# EAGLE design PS4 controller breakout (EAGLE 9.7.0)
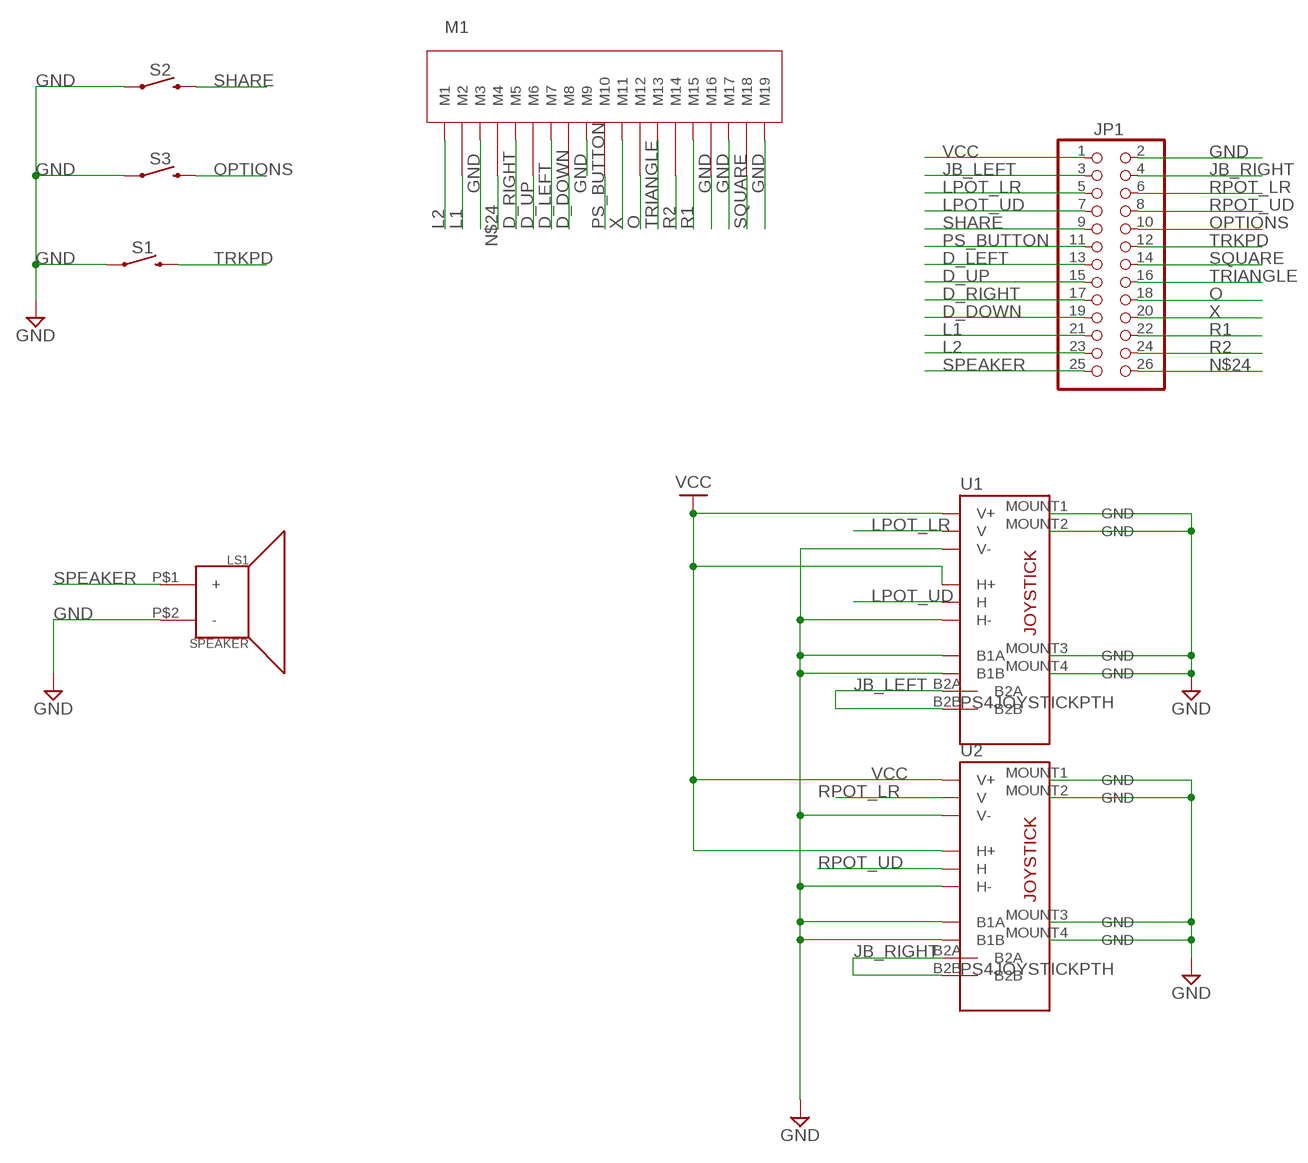
[diagram p0: schematic, sheet 1]

## Parts
JP1  PINHD-2X13  [2X13]
LS1  SPEAKER  [PS4_SPEAKER]
M1  PS4MEMBRANE  [PS4MEMBRANE]
S1  MOMENTARY-SWITCH-SPST-SMD-5.2MM  [TACTILE_SWITCH_SMD_6MM]
S2  MOMENTARY-SWITCH-SPST-SMD-4.5MM  [TACTILE_SWITCH_SMD_3.6MM]
S3  MOMENTARY-SWITCH-SPST-SMD-4.5MM  [TACTILE_SWITCH_SMD_3.6MM]
U1  PS4JOYSTICKPTH  [PS4JOYSTICK]
U2  PS4JOYSTICKPTH  [PS4JOYSTICK]

## Nets
D_DOWN: JP1.19 M1.8(M8)
D_LEFT: JP1.13 M1.7(M7)
D_RIGHT: JP1.17 M1.5(M5)
D_UP: JP1.15 M1.6(M6)
GND: JP1.2 LS1.P$2(-) M1.3(M3) M1.9(M9) M1.16(M16) M1.17(M17) M1.19(M19) S1.1 S2.2 S2.3 S3.2 S3.3 U1.B1A U1.B1B U1.H3(H-) U1.MOUNT1(GND) U1.MOUNT2(GND) U1.MOUNT3(GND) U1.MOUNT4(GND) U1.V3(V-) U2.B1A U2.B1B U2.H3(H-) U2.MOUNT1(GND) U2.MOUNT2(GND) U2.MOUNT3(GND) U2.MOUNT4(GND) U2.V3(V-)
JB_LEFT: JP1.3 U1.B2A U1.B2B
JB_RIGHT: JP1.4 U2.B2A U2.B2B
L1: JP1.21 M1.2(M2)
L2: JP1.23 M1.1(M1)
LPOT_LR: JP1.5 U1.V2(V)
LPOT_UD: JP1.7 U1.H2(H)
N$24: JP1.26 M1.4(M4)
O: JP1.18 M1.12(M12)
OPTIONS: JP1.10 S3.1 S3.4
PS_BUTTON: JP1.11 M1.10(M10)
R1: JP1.22 M1.15(M15)
R2: JP1.24 M1.14(M14)
RPOT_LR: JP1.6 U2.V2(V)
RPOT_UD: JP1.8 U2.H2(H)
SHARE: JP1.9 S2.1 S2.4
SPEAKER: JP1.25 LS1.P$1(+)
SQUARE: JP1.14 M1.18(M18)
TRIANGLE: JP1.16 M1.13(M13)
TRKPD: JP1.12 S1.3
VCC: JP1.1 U1.H1(H+) U1.V1(V+) U2.H1(H+) U2.V1(V+)
X: JP1.20 M1.11(M11)

## Library data of the parts
JP1 = pinhead:PINHD-2X13: PIN HEADER
LS1 = controller:SPEAKER: Speaker Generic 2-terminal loudspeakers SparkFun Products Speaker - PCB Mount <https://www.sparkfun.com/products/11089> (COM-11089)
M1 = controller:PS4MEMBRANE
S1 = controller:MOMENTARY-SWITCH-SPST: Momentary Switch (Pushbutton) - SPST Normally-open (NO) SPST momentary switches (buttons, pushbuttons). Variants PTH-12MM - 12mm square, through-hole Momentary Pushbutton Switch - 12mm Square <https://www.sparkfun.com/products/9190> (COM-09190) PTH-6.0MM, PTH-6.0MM-KIT - 6.0mm square, through-hole Mini Pushbutton Switch <https://www.sparkfun.com/products/97> (COM-00097) KIT package intended for soldering kit's - only one side of pads' copper is exposed. PTH-RIGHT-ANGLE-KIT - Right-angle, through-hole Right Angle Tactile Button <https://www.sparkfun.com/products/10791> - Used on SparkFun BigTime Watch Kit <https://www.sparkfun.com/products/11734> SMD-12MM - 12mm square, surface-mount Tactile Button - SMD (12mm) <https://www.sparkfun.com/products/12993> (COM-12993) Used on SparkFun PicoBoard <https://www.sparkfun.com/products/11888> SMD-4.5MM - 4.5mm Square Trackball Switch Used on SparkFun Blackberry Trackballer Breakout <https://www.sparkfun.com/products/13169> SMD-4.6MMX2.8MM - 4.60mm x 2.80mm, surface mount Used on SparkFun SAMD21 Mini Breakout <https://www.sparkfun.com/products/13664> SMD-5.2MM, SMD-5.2-REDUNDANT - 5.2mm square, surface-mount Mini Pushbutton Switch - SMD <https://www.sparkfun.com/products/8720> (COM-08720) Used on Arduino Pro Mini <https://www.sparkfun.com/products/11114> REDUNDANT package connects both switch circuits together SMD-6.0X3.5MM - 6.0 x 3.5mm, surface mount Momentary Reset Switch SMD <https://www.sparkfun.com/products/8229> (COM-08229) SMD-6.2MM-TALL - 6.2mm square, surface mount Tactile Button - SMD (6mm) <https://www.sparkfun.com/products/12992> Used on SparkFun Digital Sandbox <https://www.sparkfun.com/products/12651> SMD-RIGHT-ANGLE - Right-angle, surface mount Used on SparkFun Block for Intel® Edison - Arduino <https://www.sparkfun.com/products/13036>; PROD_ID: SWCH-08247; SF_SKU: COM-08720
S2 S3 = controller:MOMENTARY-SWITCH-SPST: Momentary Switch (Pushbutton) - SPST Normally-open (NO) SPST momentary switches (buttons, pushbuttons). Variants PTH-12MM - 12mm square, through-hole Momentary Pushbutton Switch - 12mm Square <https://www.sparkfun.com/products/9190> (COM-09190) PTH-6.0MM, PTH-6.0MM-KIT - 6.0mm square, through-hole Mini Pushbutton Switch <https://www.sparkfun.com/products/97> (COM-00097) KIT package intended for soldering kit's - only one side of pads' copper is exposed. PTH-RIGHT-ANGLE-KIT - Right-angle, through-hole Right Angle Tactile Button <https://www.sparkfun.com/products/10791> - Used on SparkFun BigTime Watch Kit <https://www.sparkfun.com/products/11734> SMD-12MM - 12mm square, surface-mount Tactile Button - SMD (12mm) <https://www.sparkfun.com/products/12993> (COM-12993) Used on SparkFun PicoBoard <https://www.sparkfun.com/products/11888> SMD-4.5MM - 4.5mm Square Trackball Switch Used on SparkFun Blackberry Trackballer Breakout <https://www.sparkfun.com/products/13169> SMD-4.6MMX2.8MM - 4.60mm x 2.80mm, surface mount Used on SparkFun SAMD21 Mini Breakout <https://www.sparkfun.com/products/13664> SMD-5.2MM, SMD-5.2-REDUNDANT - 5.2mm square, surface-mount Mini Pushbutton Switch - SMD <https://www.sparkfun.com/products/8720> (COM-08720) Used on Arduino Pro Mini <https://www.sparkfun.com/products/11114> REDUNDANT package connects both switch circuits together SMD-6.0X3.5MM - 6.0 x 3.5mm, surface mount Momentary Reset Switch SMD <https://www.sparkfun.com/products/8229> (COM-08229) SMD-6.2MM-TALL - 6.2mm square, surface mount Tactile Button - SMD (6mm) <https://www.sparkfun.com/products/12992> Used on SparkFun Digital Sandbox <https://www.sparkfun.com/products/12651> SMD-RIGHT-ANGLE - Right-angle, surface mount Used on SparkFun Block for Intel® Edison - Arduino <https://www.sparkfun.com/products/13036>; PROD_ID: SWCH-09213
U1 U2 = ps4joystick:PS4JOYSTICK: Thumb Joystick Joystick commonly found in PS2 controllers. Two pots and a select switch. Adapted from Sparkfun Library (but for more common 6mm switch sticks)

## Board
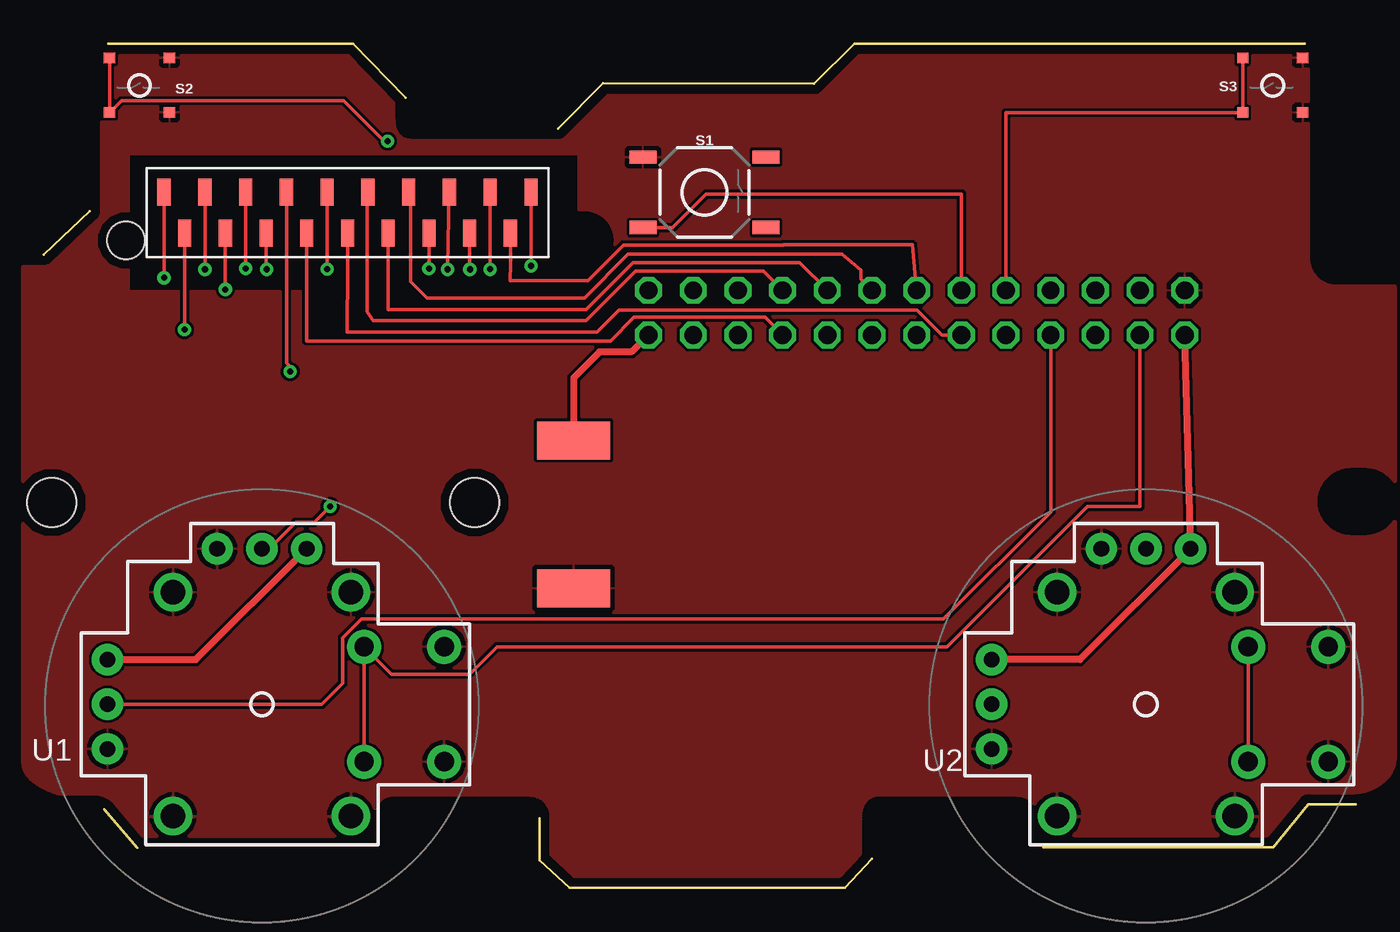
[diagram p1: board, top side]
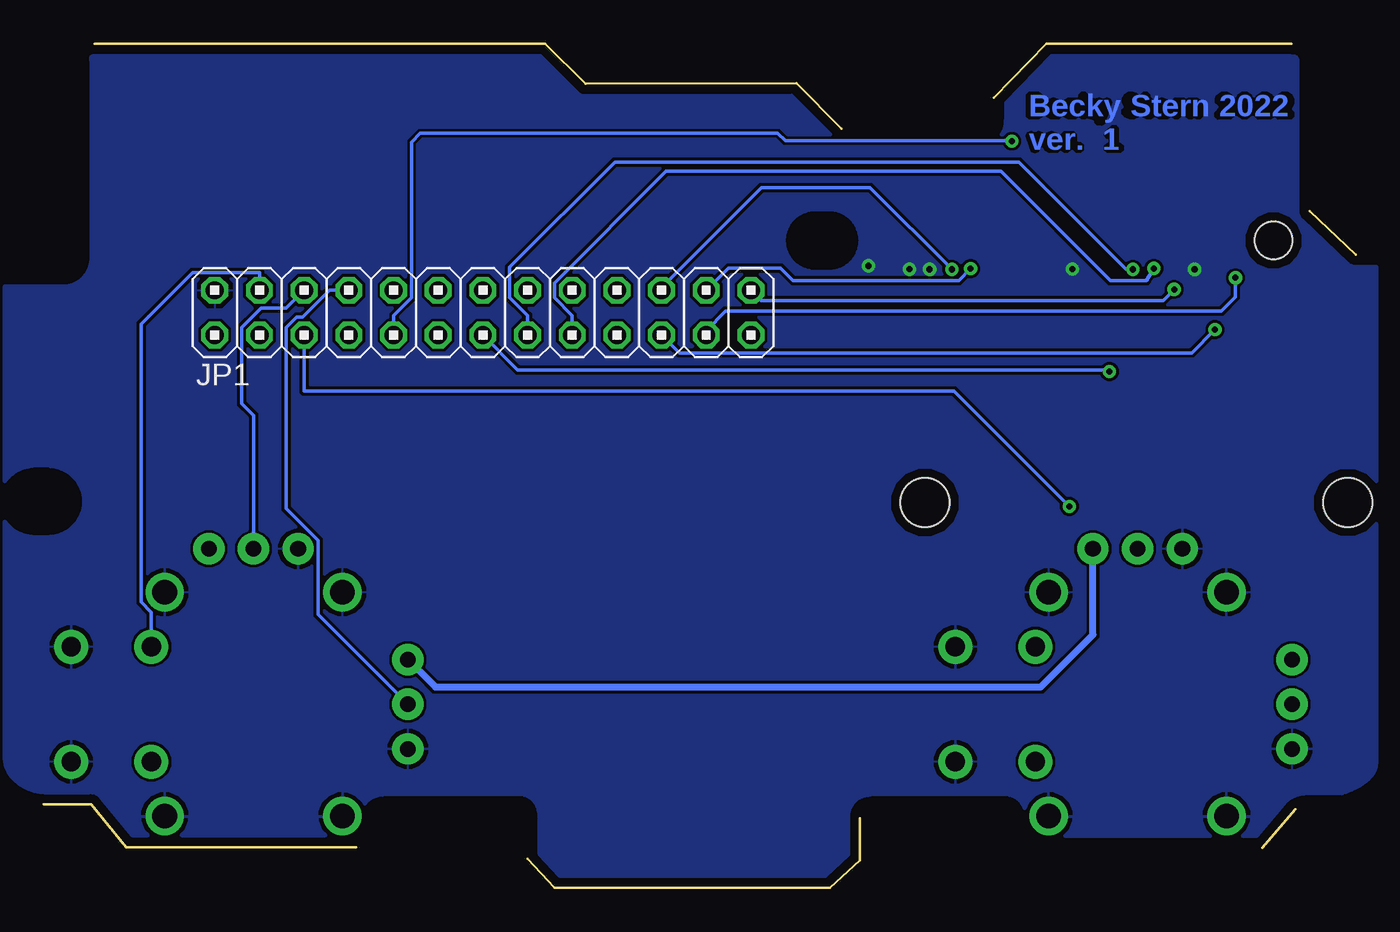
[diagram p2: board, bottom side, seen from below]

Size 74.56 x 47.99 mm. Coordinates in mm from the lower left corner, seen from the top.
Outline: 2.61,38.49 0,36.01
Outline: 3.43,4.48 5.29,2.27
Outline: 28.17,3.97 28.17,1.56 29.87,0 45.55,0 47.07,1.66
Outline: 56.83,2.31 69.88,2.31 71.88,4.75 74.56,4.75
Outline: 71.68,47.99 46.07,47.99 43.78,45.72 31.79,45.76 29.22,43.17
Outline: 20.56,44.93 17.57,47.99 3.66,47.99
Copper layers (1*16): Top / Bottom
Stack-up Default Layer Stack: Top User Defined 0.035mm / Dielectric-1 User Defined 1.5mm / Bottom User Defined 0.035mm
Design rules "default *": minimum track width 8mil, minimum drill 0.35mm, track to track 6mil, track to pad 6mil, pad to pad 6mil, via to via 6mil, smd to smd 6mil, copper to edge 20mil, drill to drill 10mil, minimum pad ring 10mil, minimum via ring 8mil, stop-mask expansion 4mil, vias tented up to drill 20mil, thermal gap 10mil
Holes 2.8 mm at 24.48,21.91 0.45,21.91
Holes 2.14 mm at 4.66,36.81

### Footprints (pad centres in the part's own frame; a part is rotated, then mirrored left to right if it is on the bottom)
2X13 = drill 1.016 octagon: 1 -15.24,-1.27; 2 -15.24,1.27; 3 -12.7,-1.27; 4 -12.7,1.27; 5 -10.16,-1.27; 6 -10.16,1.27; 7 -7.62,-1.27; 8 -7.62,1.27; 9 -5.08,-1.27; 10 -5.08,1.27; 11 -2.54,-1.27; 12 -2.54,1.27; 13 0,-1.27; 14 0,1.27; 15 2.54,-1.27; 16 2.54,1.27; 17 5.08,-1.27; 18 5.08,1.27; 19 7.62,-1.27; 20 7.62,1.27; 21 10.16,-1.27; 22 10.16,1.27; 23 12.7,-1.27; 24 12.7,1.27; 25 15.24,-1.27; 26 15.24,1.27
PS4_SPEAKER = smd 4.166 x 2.159: P$1 -0.076,4.242; P$2 -0.076,-4.166
PS4MEMBRANE = smd 0.752 x 1.529: 1 -10.431,1.161; 2 -9.262,-1.161; 3 -8.105,1.161; 4 -6.947,-1.161; 5 -5.789,1.161; 6 -4.631,-1.161; 7 -3.473,1.161; 8 -2.316,-1.161; 9 -1.158,1.161; 10 0,-1.161; 11 1.158,1.161; 12 2.316,-1.161; 13 3.473,1.161; 14 4.631,-1.161; 15 5.789,1.161; 16 6.947,-1.161; 17 8.105,1.161; 18 9.262,-1.161; 19 10.431,1.161
TACTILE_SWITCH_SMD_6MM = smd 1.524 x 0.762: 1 -3.5,2; 2 3.5,2; 3 -3.5,-2; 4 3.5,-2
TACTILE_SWITCH_SMD_3.6MM = smd 0.6 x 0.65: 1 1.55,1.7; 2 1.55,-1.7; 3 -1.55,-1.7; 4 -1.55,1.7
PS4JOYSTICK = drill 1.1 pad 1.93: B1A -3.269,10.362; B1B 3.269,10.362; B2A -3.269,5.81; B2B 3.269,5.81 | drill 0.889 pad 1.778: H1 -2.54,-8.781; H2 0,-8.781; H3 2.54,-8.781; V1 -8.838,2.54; V2 -8.838,0; V3 -8.838,-2.54 | drill 1.397 pad 2.184: MOUNT1 -6.367,5.049; MOUNT2 -6.367,-5.049; MOUNT3 6.367,-5.049; MOUNT4 6.367,5.049

### Placement (x,y rotation side)
JP1  49.61,32.71 0 bottom
LS1  30.18,21.2 0 top
M1  17.26,38.4 0 top
S1  37.55,39.55 0 top
S2  5.43,45.64 90 top
S3  69.86,45.64 90 top
U1  12.39,10.44 270 top
U2  62.65,10.44 270 top

### Tracks (layer width: path | path; a pad name or v marks a point on that pad's centre or on a via)
D_DOWN
  Top 0.203: JP1.19 40.98,32.46 33.56,32.46 32.21,31.11 14.94,31.11 M1.8
D_LEFT  (via drill 0.35)
  Top 0.203: M1.7 13.78,29.86 13.99,29.65 v13.99,29.36
  Bottom 0.203: JP1.13 47.63,29.46 14.09,29.46 v13.99,29.36
D_RIGHT  (via drill 0.35)
  Top 0.203: M1.5 v11.47,35.22
  Bottom 0.203: JP1.17 44.53,32.55 45.55,33.56 45.55,34.4 39.19,40.76 20.16,40.76 13.93,34.54 11.9,34.54 v11.47,35.22
D_UP  (via drill 0.35)
  Top 0.203: M1.6 12.62,35.21 v12.66,35.17
  Bottom 0.203: v12.66,35.17 13.04,35.17 19.14,41.27 42.11,41.27 48.09,35.29 48.09,33.56 47.07,32.55 JP1.15
GND  (via drill 0.35)
  Top 0.203: M1.19 v27.69,35.37 27.69,35.26 | M1.16 24.2,35.19 v24.22,35.17 | M1.3 v9.15,35.17 | M1.9 v16.1,35.19 | v25.36,35.18 M1.17
  pour Top: 0.75,4.68 0.75,4.68 -1.87,5.29 -1.87,8.96 -1.87,35.57 -1.87,35.57 -1.87,35.57 -1.87,35.57 -1.87,35.57 -1.87,36.01 -1.05,36.01 0,36.01 0,36.01 0,36.01 2.61,38.49 2.61,38.49 2.61,46.78 2.61,47.04 2.61,47.52 2.93,47.99 3.66,47.99 3.66,47.99 17.57,47.99 20.56,44.93 20.56,44.93 20.56,44.05 20.56,43.31 20.67,43.17 21.21,43.17 29.22,43.17 29.22,43.17 29.22,43.17 31.79,45.76 43.78,45.72 46.07,47.99 71.68,47.99 72.7,47.99 72.6,47.04 72.53,46.97 72.56,35.7 72.56,35.7 72.56,35.7 72.56,35.7 72.56,35.7 72.7,34.89 74.19,34.89 77.08,34.89 77.08,34.89 77.08,34.89 77.08,34.89 77.08,34.89 77.48,34.99 77.48,34.04 77.48,9.08 77.48,5.72 75.78,4.76 74.56,4.75 74.56,4.75 71.88,4.75 69.88,2.31 56.83,2.31 56.83,2.31 55.88,2.24 55.88,3.8 55.85,4.14 55.85,4.14 55.85,4.14 55.85,4.14 55.85,4.14 55.88,4.62 54.59,4.62 47.38,4.62 47.38,4.62 47.38,4.62 47.38,4.62 47.38,4.62 47.07,4.55 47.07,3.39 47.07,1.66 47.07,1.66 47.07,1.66 45.55,0 29.87,0 28.17,1.56 28.17,3.97 28.17,3.97 28.2,4.62 26.91,4.62 19.79,4.62 19.79,4.62 19.79,4.62 19.79,4.62 19.79,4.62 19.41,4.58 19.41,3.36 19.41,3.31 19.41,2.52 19.18,2.27 18.23,2.27 5.29,2.27 5.29,2.27 5.29,2.27 3.43,4.48 3.43,4.48 3.19,4.68 2.51,4.68 0.75,4.68 0.75,4.68
  pour Bottom: 0.75,4.68 0.75,4.68 -1.87,5.29 -1.87,8.96 -1.87,35.57 -1.87,35.57 -1.87,35.57 -1.87,35.57 -1.87,35.57 -1.87,36.01 -1.05,36.01 0,36.01 0,36.01 0,36.01 2.61,38.49 2.61,38.49 2.61,46.78 2.61,47.04 2.61,47.52 2.93,47.99 3.66,47.99 3.66,47.99 17.57,47.99 20.56,44.93 20.56,44.93 20.56,44.05 20.56,43.31 20.67,43.17 21.21,43.17 29.22,43.17 29.22,43.17 29.22,43.17 31.77,45.74 43.76,45.7 46.07,47.99 71.68,47.99 72.7,47.99 72.6,47.04 72.53,46.97 72.56,35.7 72.56,35.7 72.56,35.7 72.56,35.7 72.56,35.7 72.7,34.89 74.19,34.89 77.08,34.89 77.08,34.89 77.08,34.89 77.08,34.89 77.08,34.89 77.48,34.99 77.48,34.04 77.48,9.08 77.48,5.72 75.78,4.76 74.56,4.75 74.56,4.75 71.88,4.75 69.88,2.31 56.83,2.31 56.83,2.31 55.88,2.24 55.88,3.8 55.85,4.14 55.85,4.14 55.85,4.14 55.85,4.14 55.85,4.14 55.88,4.62 54.59,4.62 47.38,4.62 47.38,4.62 47.38,4.62 47.38,4.62 47.38,4.62 47.07,4.55 47.07,3.39 47.07,1.66 47.07,1.66 47.07,1.66 45.55,0 29.87,0 28.17,1.56 28.17,3.97 28.17,3.97 28.2,4.62 26.91,4.62 19.79,4.62 19.79,4.62 19.79,4.62 19.79,4.62 19.79,4.62 19.41,4.58 19.41,3.36 19.41,3.31 19.41,2.52 19.18,2.27 18.23,2.27 5.29,2.27 5.29,2.27 5.29,2.27 3.43,4.48 3.43,4.48 3.19,4.68 2.51,4.68 0.75,4.68 0.75,4.68
JB_LEFT
  Top 0.203: U1.B2B U1.B2A 19.76,12.16 24.19,12.16 25.75,13.71 51.33,13.71 59.31,21.7 62.31,21.7 JP1.3
JB_RIGHT
  Top 0.203: U2.B2A U2.B2B
  Bottom 0.203: U2.B2A 68.46,15.67 69.05,16.25 69.05,32.06 66.11,35 62.31,35 JP1.4
L1  (via drill 0.35)
  Top 0.203: v7.99,31.75 M1.2
  Bottom 0.203: JP1.21 38.44,30.43 9.31,30.43 v7.99,31.75
L2  (via drill 0.35)
  Top 0.203: M1.1 v6.83,34.7
  Bottom 0.203: v6.83,34.7 6.83,33.6 7.64,32.79 30.31,32.79 35.82,32.79 36.91,31.7 JP1.23
LPOT_LR  (via drill 0.35)
  Top 0.203: v16.27,21.7 15.36,20.78 14.31,20.78 12.81,19.28 U1.V2
  Bottom 0.203: JP1.5 59.77,28.25 22.83,28.25 v16.27,21.7
LPOT_UD
  Top 0.203: U1.H2 15.79,10.44 16.98,11.63 16.98,14.22 18.05,15.29 51.13,15.29 57.23,21.39 JP1.7
N$24  (via drill 0.35)
  Top 0.203: v10.31,34.03 M1.4
  Bottom 0.203: v10.31,34.03 10.94,33.4 33.79,33.4 JP1.26
O
  Top 0.203: M1.12 19.57,32.89 30.82,32.89 33.49,35.56 42.96,35.56 JP1.18
OPTIONS
  Top 0.203: S3.1 S3.4 54.69,44.09 JP1.10
PS_BUTTON
  Top 0.203: M1.10 17.26,35.3 17.24,31.62 31.45,31.62 32.69,32.86 49.63,32.86 51.05,31.44 JP1.11
R1  (via drill 0.35)
  Top 0.203: M1.15 22.95,35.3 v22.95,35.17
  Bottom 0.203: v22.95,35.17 27.6,39.83 33.78,39.83 39.45,34.15 JP1.22
R2  (via drill 0.35)
  Top 0.203: M1.14 v21.89,35.21
  Bottom 0.203: v21.89,35.21 22.56,34.54 31.97,34.54 32.68,35.25 35.64,35.25 JP1.24
RPOT_LR
  Bottom 0.203: U2.V2 62.65,26.87 63.33,27.55 63.33,31.86 62.22,32.97 60.79,32.97 JP1.6
RPOT_UD
  Bottom 0.203: U2.H2 58.97,15.54 58.97,19.76 60.79,21.57 60.79,31.86 60.19,32.46 59.86,32.46 58.34,33.98 JP1.8
SHARE  (via drill 0.35)
  Top 0.203: S2.1 S2.4 4.41,44.77 17.03,44.77 19.34,42.46 v19.54,42.46
  Bottom 0.203: JP1.9 54.69,32.55 53.68,33.56 53.68,42.42 53.17,42.92 32.85,42.92 32.41,42.48 19.56,42.48 v19.54,42.46
SPEAKER
  Top 0.406: JP1.25 33.4,30.47 31.58,30.47 30.11,29 LS1.P$1
SQUARE
  Top 0.203: M1.18 26.52,35.48 26.51,35.48 26.5,34.54 30.92,34.54 32.94,36.56 42.07,36.56 42.08,36.57 49.36,36.57 JP1.14
TRIANGLE
  Top 0.203: M1.13 20.86,39.43 20.86,34.47 21.78,33.55 30.72,33.55 33.21,36.04 45.36,36.04 46.44,35.13 46.44,34.62 JP1.16
TRKPD
  Top 0.203: S1.3 35.74,37.55 37.64,39.46 52.15,39.46 JP1.12
VCC
  Top 0.406: U1.H1 8.63,12.98 U1.V1 | U2.H1 58.89,12.98 U2.V1 JP1.1
  Bottom 0.406: U2.H1 52.31,11.43 17.9,11.43 14.93,14.4 U1.V1
X
  Top 0.203: M1.11 18.37,39.52 18.37,32.76 18.71,32.25 30.82,32.25 33.64,35.07 40.9,35.07 JP1.20
(copper drawn outside any net)
  shapes: Top area x1

### Text on the board
Bottom: Becky Stern 2022 / ver. 1